# EAGLE design ciborg-4 (EAGLE 4.13)
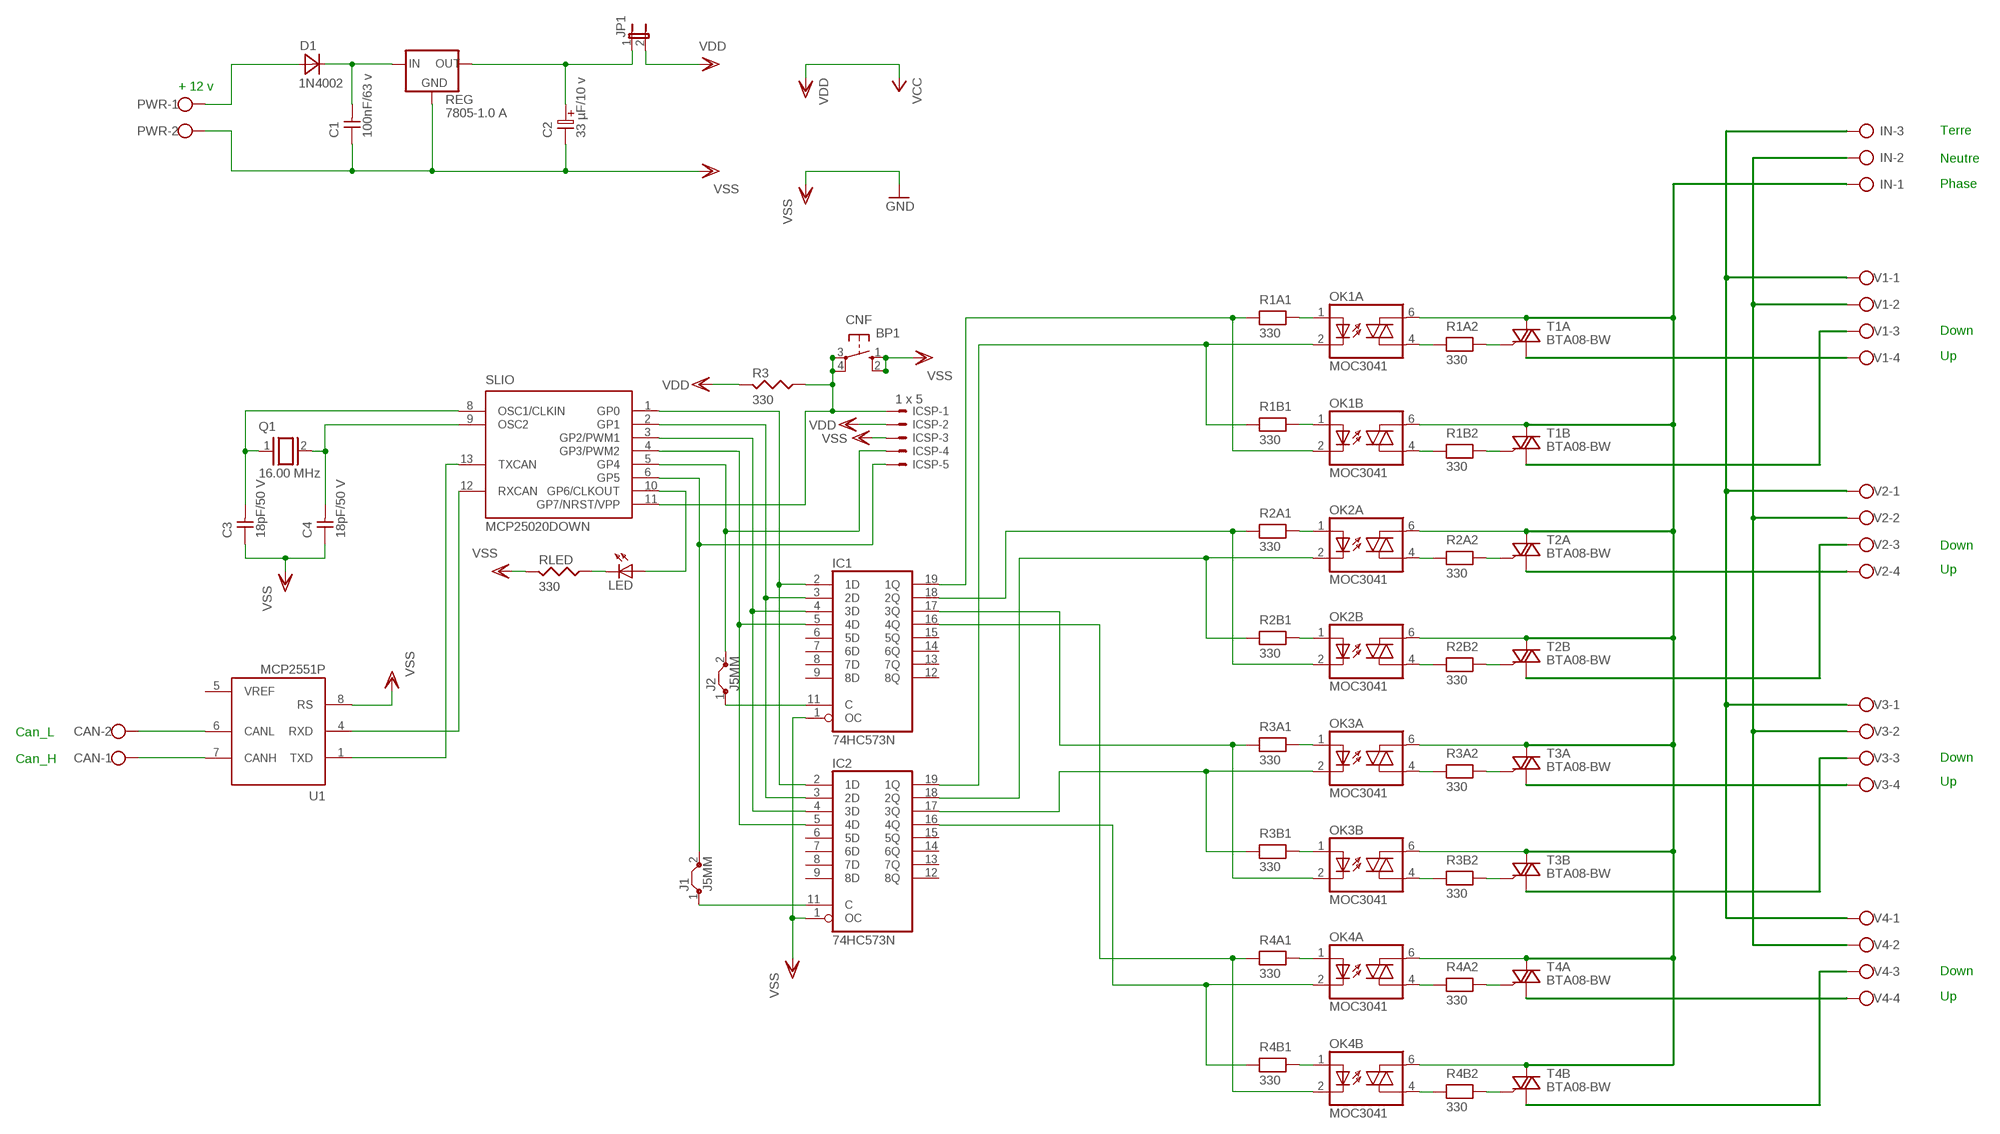
[diagram p0: schematic, sheet 1]

## Parts
C1  100nF/63 v  CAPNP-5  [C-5]
C2  33 µF/10 v  ELC-2,5L  [ES-2,5L]
C3  18pF/50 V  CAPNP-5  [C-5]
C4  18pF/50 V  CAPNP-5  [C-5]
CAN  AK550/2  [AK550/2]
CNF  BP1  10-XX  [B3F-10XX]
D1  1N4002  DIODE-10  [D-10]
IC1  74HC573N  [DIL20]
IC2  74HC573N  [DIL20]
ICSP  1 x 5  53047-05  [53047-05]
IN  AK500/3  [AK500/3]
J1  J5MM  [05]
J2  J5MM  [05]
JP1  JP1E  [JP1]
LED  LED3MM  [LED3MM]
OK1A  MOC3041  IL420  [DIL06]
OK1B  MOC3041  IL420  [DIL06]
OK2A  MOC3041  IL420  [DIL06]
OK2B  MOC3041  IL420  [DIL06]
OK3A  MOC3041  IL420  [DIL06]
OK3B  MOC3041  IL420  [DIL06]
OK4A  MOC3041  IL420  [DIL06]
OK4B  MOC3041  IL420  [DIL06]
PWR  AK550/2  [AK550/2]
Q1  16.00 MHz  XTAL/S  [QS]
R1A1  330  RESEU-7,5  [R-7,5]
R1A2  330  RESEU-S2,5  [RS-2,5]
R1B1  330  RESEU-7,5  [R-7,5]
R1B2  330  RESEU-S2,5  [RS-2,5]
R2A1  330  RESEU-7,5  [R-7,5]
R2A2  330  RESEU-S2,5  [RS-2,5]
R2B1  330  RESEU-7,5  [R-7,5]
R2B2  330  RESEU-S2,5  [RS-2,5]
R3  330  RESUS-S2,5  [RS-2,5]
R3A1  330  RESEU-7,5  [R-7,5]
R3A2  330  RESEU-S2,5  [RS-2,5]
R3B1  330  RESEU-7,5  [R-7,5]
R3B2  330  RESEU-S2,5  [RS-2,5]
R4A1  330  RESEU-7,5  [R-7,5]
R4A2  330  RESEU-S2,5  [RS-2,5]
R4B1  330  RESEU-7,5  [R-7,5]
R4B2  330  RESEU-S2,5  [RS-2,5]
REG  7805-1.0 A  78XXS  [78XXS]
RLED  330  RESUS-S2,5  [RS-2,5]
SLIO  MCP25020DOWN  [SO-14DOWN]
T1A  BTA08-BW  TIC225S  [TO220DS]
T1B  BTA08-BW  TIC225S  [TO220DS]
T2A  BTA08-BW  TIC225S  [TO220DS]
T2B  BTA08-BW  TIC225S  [TO220DS]
T3A  BTA08-BW  TIC225S  [TO220DS]
T3B  BTA08-BW  TIC225S  [TO220DS]
T4A  BTA08-BW  TIC225S  [TO220DS]
T4B  BTA08-BW  TIC225S  [TO220DS]
U1  MCP2551P  [DIL8]
V1  AK500/4  [AK500/4]
V2  AK500/4  [AK500/4]
V3  AK500/4  [AK500/4]
V4  AK500/4  [AK500/4]

## Nets
CANH: CAN.1 U1.7(CANH)
CANL: CAN.2 U1.6(CANL)
N$1: LED.K(C) RLED.1
N$2: C2.1 JP1.1 REG.OUT
N$3: C4.2 Q1.2 SLIO.9(OSC2)
N$4: IC2.11(C) J1.1
N$5: ICSP.5 J1.2 SLIO.6(GP5)
N$6: C3.2 Q1.1 SLIO.8(OSC1/CLKIN)
N$7: C1.2 D1.2(K) REG.IN
N$8: SLIO.12(RXCAN) U1.4(RXD)
N$9: SLIO.13(TXCAN) U1.1(TXD)
N$10: IC1.11(C) J2.1
N$11: IC1.19(1Q) OK1B.2(C) R1A1.1
N$12: IC2.19(1Q) OK1A.2(C) R1B1.1
N$13: OK1A.1(A) R1A1.2
N$14: ICSP.4 J2.2 SLIO.5(GP4)
N$15: D1.1(A) PWR.1
N$16: LED.A SLIO.10(GP6/CLKOUT)
N$17: OK1B.1(A) R1B1.2
N$18 [AC_VOLTAGE]: T1A.A1 V1.4
N$19: OK2A.1(A) R2A1.2
N$20 [AC_VOLTAGE]: OK2B.4(A1) R2B2.1
N$21 [AC_VOLTAGE]: R2B2.2 T2B.G
N$22: OK2B.1(A) R2B1.2
N$23 [AC_VOLTAGE]: OK2A.4(A1) R2A2.1
N$24 [AC_VOLTAGE]: R2A2.2 T2A.G
N$25: IC1.18(2Q) OK2B.2(C) R2A1.1
N$26: IC2.18(2Q) OK2A.2(C) R2B1.1
N$27: OK3B.1(A) R3B1.2
N$28: OK4A.1(A) R4A1.2
N$29: OK4B.1(A) R4B1.2
N$30 [AC_VOLTAGE]: OK3B.4(A1) R3B2.1
N$31 [AC_VOLTAGE]: R3B2.2 T3B.G
N$32: OK3A.1(A) R3A1.2
N$33 [AC_VOLTAGE]: OK3A.4(A1) R3A2.1
N$34 [AC_VOLTAGE]: R3A2.2 T3A.G
N$35: IC1.17(3Q) OK3B.2(C) R3A1.1
N$36: IC2.17(3Q) OK3A.2(C) R3B1.1
N$38 [AC_VOLTAGE]: T2A.A1 V2.4
N$39 [AC_VOLTAGE]: OK1B.4(A1) R1B2.1
N$40 [AC_VOLTAGE]: R1B2.2 T1B.G
N$41 [AC_VOLTAGE]: T3A.A1 V3.4
N$42 [AC_VOLTAGE]: T4A.A1 V4.4
N$43 [AC_VOLTAGE]: OK4B.4(A1) R4B2.1
N$44 [AC_VOLTAGE]: R4B2.2 T4B.G
N$45 [AC_VOLTAGE]: T4B.A1 V4.3
N$46 [AC_VOLTAGE]: OK4A.4(A1) R4A2.1
N$47 [AC_VOLTAGE]: R4A2.2 T4A.G
N$48: IC1.16(4Q) OK4B.2(C) R4A1.1
N$49: IC2.16(4Q) OK4A.2(C) R4B1.1
N$50 [AC_VOLTAGE]: T3B.A1 V3.3
N$51 [AC_VOLTAGE]: T2B.A1 V2.3
N$52 [AC_VOLTAGE]: T1B.A1 V1.3
N$59 [AC_VOLTAGE]: OK1A.4(A1) R1A2.1
N$60 [AC_VOLTAGE]: R1A2.2 T1A.G
NEUTRE [AC_VOLTAGE]: IN.2 V1.2 V2.2 V3.2 V4.2
PHASE [AC_VOLTAGE]: IN.1 OK1A.6(A2) OK1B.6(A2) OK2A.6(A2) OK2B.6(A2) OK3A.6(A2) OK3B.6(A2) OK4A.6(A2) OK4B.6(A2) T1A.A2 T1B.A2 T2A.A2 T2B.A2 T3A.A2 T3B.A2 T4A.A2 T4B.A2
TERRE [AC_TERRE]: IN.3 V1.1 V2.1 V3.1 V4.1
VDD: ICSP.2 JP1.2 R3.2
VPP: CNF.3(P) CNF.4(P1) ICSP.1 R3.1 SLIO.11(GP7/NRST/VPP)
VR1_UP: IC1.2(1D) IC2.2(1D) SLIO.1(GP0)
VR2_UP: IC1.3(2D) IC2.3(2D) SLIO.2(GP1)
VR3_UP: IC1.4(3D) IC2.4(3D) SLIO.3(GP2/PWM1)
VR4_UP: IC1.5(4D) IC2.5(4D) SLIO.4(GP3/PWM2)
VSS: C1.1 C2.2 C3.1 C4.1 CNF.1(S) CNF.2(S1) IC1.1(OC) IC2.1(OC) ICSP.3 PWR.2 REG.GND RLED.2 U1.8(RS)
Unconnected: IC1.6(5D) IC1.7(6D) IC1.8(7D) IC1.9(8D) IC1.12(8Q) IC1.13(7Q) IC1.14(6Q) IC1.15(5Q) IC2.6(5D) IC2.7(6D) IC2.8(7D) IC2.9(8D) IC2.12(8Q) IC2.13(7Q) IC2.14(6Q) IC2.15(5Q)

## Notes on the sheet
- + 12 v
- Terre
- Neutre
- Phase
- Down
- Up
- Down
- Up
- Can_L
- Can_H | Down
- Up
- Down
- Up

## Power pins joined to a net without a drawn wire
GND: IC1.10(GND) IC2.10(GND)
VCC: IC1.20(VCC) IC2.20(VCC)
VDD: SLIO.14(VDD) U1.3(VDD)
VREF: U1.5(VREF)
VSS: SLIO.7(VSS) U1.2(VSS)

## Library data of the parts
C1 C3 C4 = discrete:CAPNP-5
C2 = discrete:ELC-2,5L
CAN PWR = con-ptr500+:AK550/2: CONNECTOR
CNF = switch-omron:10-XX: OMRON SWITCH
D1 = discrete:DIODE-10
IC1 IC2 = 74xx-eu:74*573: 8-bit D latch BUS DRIVER
ICSP = con-molex:53?-05: CONNECTOR wire to board 1.25 mm (.049 inch) pitch header
IN = con-ptr500:AK500/3: CONNECTOR
J1 J2 = jumper:J: Bridge
JP1 = jumper:JP1E: JUMPER
LED = led:LED: LED
OK1A OK1B OK2A OK2B OK3A OK3B OK4A OK4B = optocoupler:IL420: SIEMENS OPTO COUPLER
Q1 = special:XTAL/S: CRYSTAL
R1A1 R1B1 R2A1 R2B1 R3A1 R3B1 R4A1 R4B1 = discrete:RESEU-7,5
R1A2 R1B2 R2A2 R2B2 R3A2 R3B2 R4A2 R4B2 = discrete:RESEU-S2,5
R3 RLED = discrete:RESUS-S2,5
REG = v-reg:78XXS: VOLTAGE REGULATOR
SLIO = microchip_can:MCP25020: CAN I/O Expander
T1A T1B T2A T2B T3A T3B T4A T4B = triac:TIC225S: TRIAC
U1 = microchip_can:MCP2551: High Speed CAN tranceiver
V1-V4 = con-ptr500+:AK500/4: CONNECTOR

## Net classes
0 default: width 0.254 mm, drill 0.254 mm
1 AC_VOLTAGE: width 1.5 mm, drill 0.254 mm
2 AC_TERRE: width 1.422 mm, drill 0.254 mm

## Board
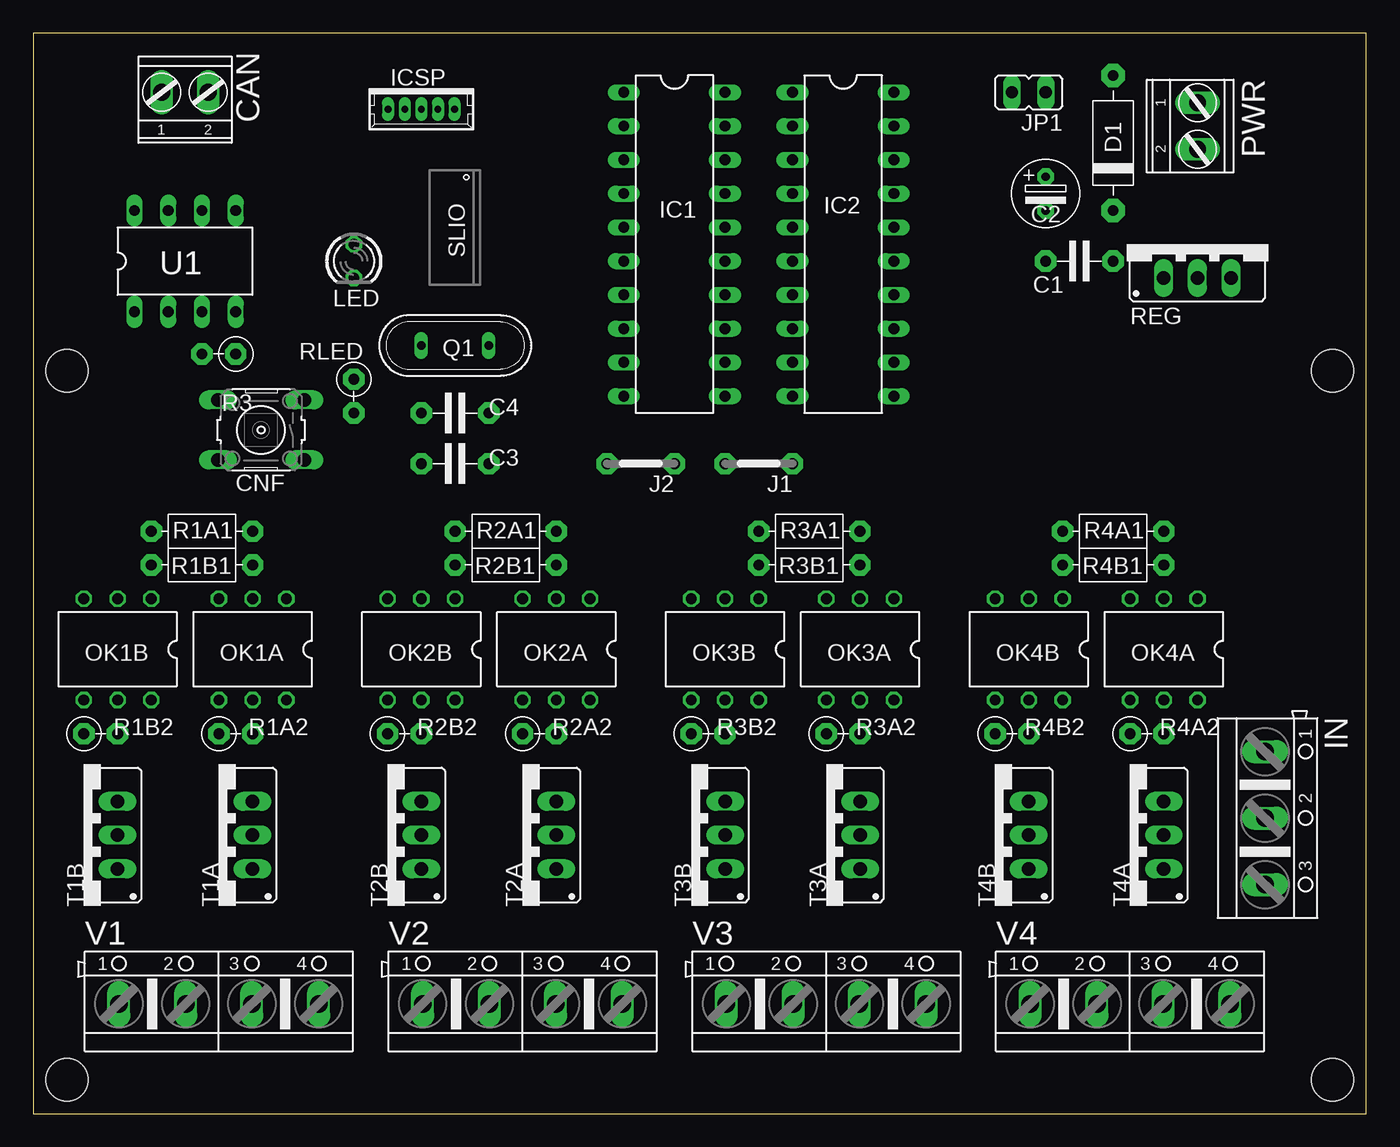
[diagram p1: board, top side]
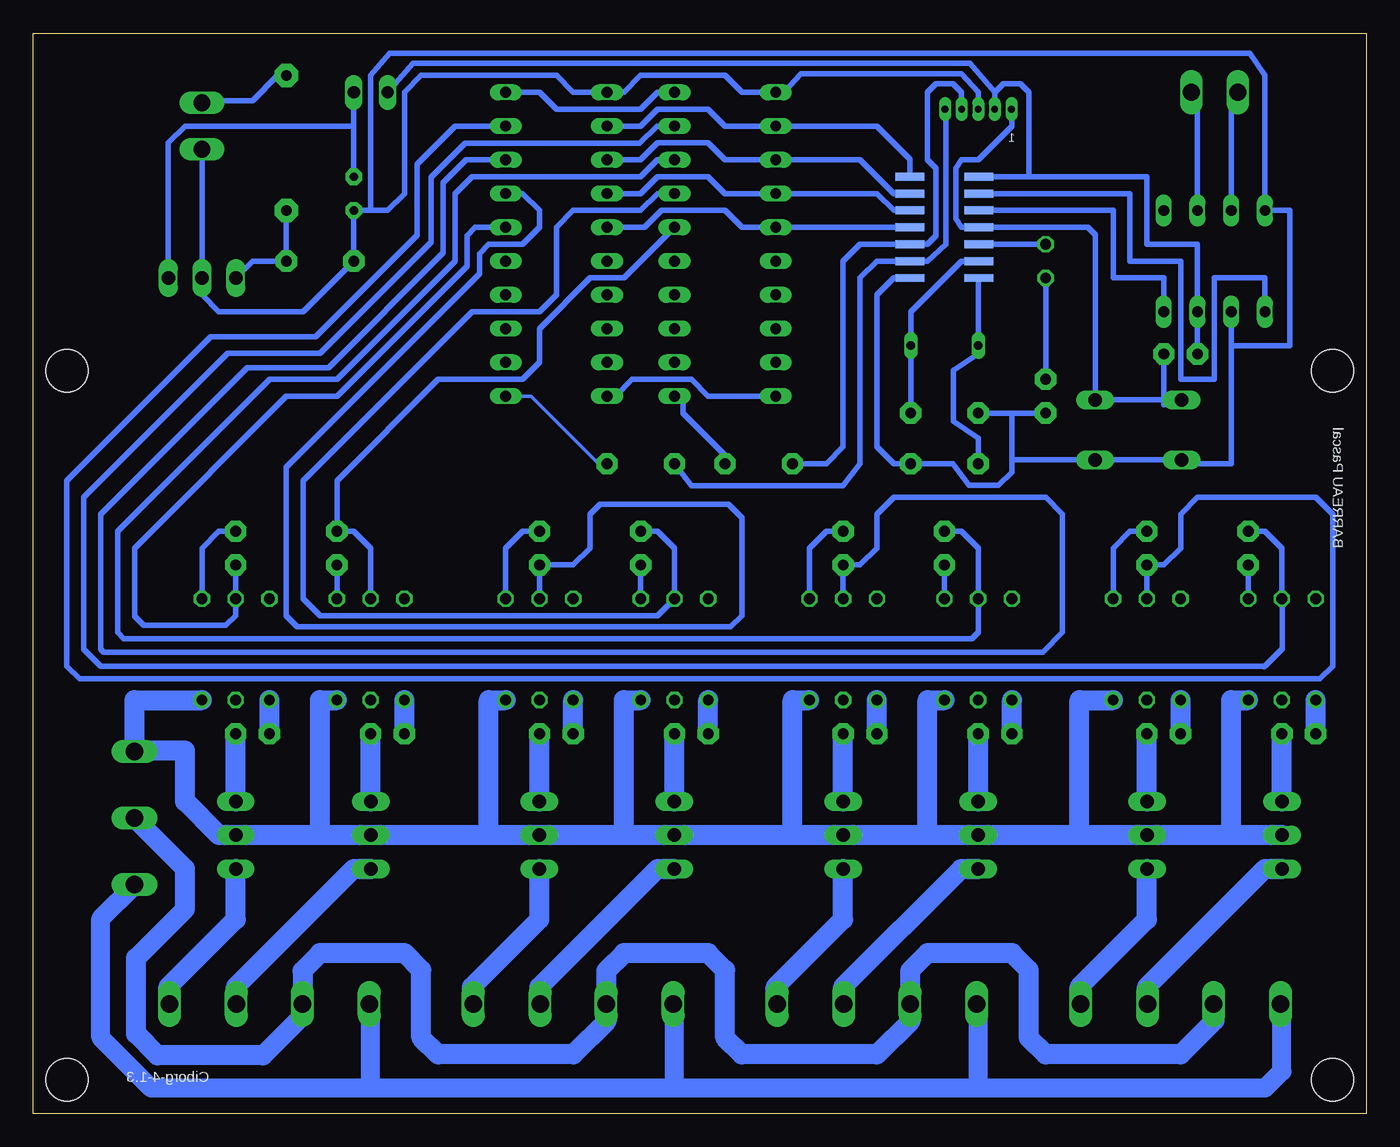
[diagram p2: board, bottom side, seen from below]

Size 100.33 x 81.28 mm. Coordinates in mm from the lower left corner, seen from the top.
Outline: 0,0 100.33,0 100.33,81.28 0,81.28 0,0
Copper layers (1*16): Top 0.0356mm / dielectric 1.5011mm / Bottom 0.0356mm
Design rules "BARREAU_DRU": minimum track width 10mil, minimum drill 19mil, track to track 10mil, track to pad 10mil, pad to pad 10mil, via to via 10mil, smd to smd 8mil, copper to edge 40mil, drill to drill 10mil, minimum pad ring 8mil, minimum via ring 8mil, stop-mask expansion 4mil, vias tented up to drill 0mil, thermal gap 10mil
Holes 3.2 mm at 97.79,2.54 2.54,2.54 2.54,55.88 97.79,55.88

### Footprints (pad centres in the part's own frame; a part is rotated, then mirrored left to right if it is on the bottom)
C-5 = drill 0.813 pad 1.6 octagon: 1 -2.54,0; 2 2.54,0
ES-2,5L = drill 0.61 pad 1.27 octagon: 1 0,0; 2 2.54,0
AK550/2 = drill 1.27 long: 1 -1.75,0; 2 1.75,0
B3F-10XX = drill 1.016 long: 1 -3.251,2.261; 2 3.251,2.261; 3 -3.251,-2.261; 4 3.251,-2.261
D-10 = drill 0.813 pad 1.778 octagon: 1 -5.08,0; 2 5.08,0
DIL20 = drill 0.813 long: 1 -11.43,-3.81; 2 -8.89,-3.81; 3 -6.35,-3.81; 4 -3.81,-3.81; 5 -1.27,-3.81; 6 1.27,-3.81; 7 3.81,-3.81; 8 6.35,-3.81; 9 8.89,-3.81; 10 11.43,-3.81; 11 11.43,3.81; 12 8.89,3.81; 13 6.35,3.81; 14 3.81,3.81; 15 1.27,3.81; 16 -1.27,3.81; 17 -3.81,3.81; 18 -6.35,3.81; 19 -8.89,3.81; 20 -11.43,3.81
53047-05 = drill 0.5 pad 0.698 long: 1 2.5,0; 2 1.25,0; 3 0,0; 4 -1.25,0; 5 -2.5,0
AK500/3 = drill 1.321 long: 1 -5.004,0; 2 0,0; 3 5.004,0
05 = drill 0.813 pad 1.6 octagon: 1 -2.54,0; 2 2.54,0
JP1 = drill 0.914 long: 1 0,-1.27; 2 0,1.27
LED3MM = drill 0.813 octagon: A -1.27,0; K 1.27,0
DIL06 = drill 0.813 octagon: 1 -2.54,-3.81; 2 0,-3.81; 3 2.54,-3.81; 4 2.54,3.81; 5 0,3.81; 6 -2.54,3.81
QS = drill 0.61 long: 1 -2.54,0; 2 2.54,0
R-7,5 = drill 0.813 pad 1.6 octagon: 1 -3.81,0; 2 3.81,0
RS-2,5 = drill 0.813 pad 1.6 octagon: 1 0,0; 2 2.54,0
78XXS = drill 1.016 long: GND 0,-2.54; IN -2.54,-2.54; OUT 2.54,-2.54
SO-14DOWN = smd 0.6 x 2.2 bottom: 1 3.81,-2.6; 2 2.54,-2.6; 3 1.27,-2.6; 4 0,-2.6; 5 -1.27,-2.6; 6 -2.54,-2.6; 7 -3.81,-2.6; 8 -3.81,2.6; 9 -2.54,2.6; 10 -1.27,2.6; 11 0,2.6; 12 1.27,2.6; 13 2.54,2.6; 14 3.81,2.6
TO220DS = drill 1.016 long: A1 -2.54,-2.54; A2 0,-2.54; G 2.54,-2.54
DIL8 = drill 0.813 long: 1 -3.81,-3.81; 2 -1.27,-3.81; 3 1.27,-3.81; 4 3.81,-3.81; 5 3.81,3.81; 6 1.27,3.81; 7 -1.27,3.81; 8 -3.81,3.81
AK500/4 = drill 1.321 long: 1 -7.518,0; 2 -2.489,0; 3 2.489,0; 4 7.518,0

### Placement (x,y rotation side)
C1  78.74,64.14 0 top
C2  76.2,70.48 270 top
C3  31.75,48.9 180 top
C4  31.75,52.7 0 top
CAN  11.43,76.83 0 top
CNF  17.14,51.44 180 top
D1  81.28,73.03 270 top
IC1  48.26,65.41 270 top
IC2  60.96,65.41 270 top
ICSP  29.21,75.56 180 top
IN  92.71,22.23 270 top
J1  54.61,48.9 180 top
J2  45.72,48.9 180 top
JP1  74.93,76.83 90 top
LED  24.13,64.14 270 top
OK1A  16.51,34.92 180 top
OK1B  6.35,34.92 180 top
OK2A  39.37,34.92 180 top
OK2B  29.21,34.92 180 top
OK3A  62.23,34.92 180 top
OK3B  52.07,34.92 180 top
OK4A  85.09,34.92 180 top
OK4B  74.93,34.92 180 top
PWR  87.63,74.3 270 top
Q1  31.75,57.78 0 top
R1A1  12.7,43.81 0 top
R1A2  13.97,28.57 0 top
R1B1  12.7,41.27 180 top
R1B2  3.81,28.57 0 top
R2A1  35.56,43.81 0 top
R2A2  36.83,28.57 0 top
R2B1  35.56,41.27 180 top
R2B2  26.67,28.57 0 top
R3  15.24,57.15 180 top
R3A1  58.42,43.81 0 top
R3A2  59.69,28.57 0 top
R3B1  58.42,41.27 180 top
R3B2  49.53,28.57 0 top
R4A1  81.28,43.81 0 top
R4A2  82.55,28.57 0 top
R4B1  81.28,41.27 180 top
R4B2  72.39,28.57 0 top
REG  87.63,65.41 0 top
RLED  24.13,55.24 270 top
SLIO  31.75,66.67 90 top
T1A  13.97,20.95 90 top
T1B  3.81,20.95 90 top
T2A  36.83,20.95 90 top
T2B  26.67,20.95 90 top
T3A  59.69,20.95 90 top
T3B  49.53,20.95 90 top
T4A  82.55,20.95 90 top
T4B  72.39,20.95 90 top
U1  11.43,64.14 0 top
V1  13.97,8.26 0 top
V2  36.83,8.26 0 top
V3  59.69,8.26 0 top
V4  82.55,8.26 0 top

### Tracks (layer width: path | path; a pad name or v marks a point on that pad's centre or on a via)
CANH
  Bottom 0.406: U1.7 10.16,75.56 CAN.1
CANL
  Bottom 0.406: U1.6 12.7,75.56 CAN.2
GND
  Bottom 0.406: IC1.10 49.53,53.98 50.8,55.24 55.24,55.24 56.52,53.98 IC2.10
N$1
  Bottom 0.406: RLED.1 LED.K
N$2
  Bottom 0.406: C2.1 76.2,74.3 | 76.2,74.3 JP1.1 | 76.2,74.3 88.9,74.3 90.17,73.03 REG.OUT
N$3
  Bottom 0.406: C4.2 Q1.2 34.29,60.33 30.48,64.14 SLIO.9
N$4
  Bottom 0.254: IC2.11 62.87,53.98 57.78,48.9 J1.1
N$5
  Bottom 0.254: 31.64,74.93 ICSP.5
  Bottom 0.406: 31.64,74.93 31.64,65.41 33.02,64.14 SLIO.6 36.83,64.14 38.1,62.87 38.1,48.9 39.37,47.22 50.8,47.22 J1.2
N$6
  Bottom 0.254: 29.21,62.87 SLIO.8
  Bottom 0.406: 29.21,62.87 Q1.1 29.21,57.15 31.06,55.91 31.06,52.1 29.21,50.8 C3.2
N$7
  Bottom 0.406: REG.IN 83.82,64.14 C1.2 D1.2
N$8
  Bottom 0.406: SLIO.12 19.05,67.94 19.05,62.87 15.24,62.87 U1.4
N$9
  Bottom 0.406: U1.1 7.62,62.87 11.43,62.87 11.43,55.24 13.97,55.24 13.97,64.14 17.78,64.14 17.78,69.22 SLIO.13
N$10
  Bottom 0.254: 51.44,53.98 IC1.11
  Bottom 0.406: 51.44,53.98 51.44,52.7 48.26,49.53 J2.1
N$11
  Bottom 0.254: 7.64,33.67 7.62,33.66
  Bottom 0.406: IC1.19 53.39,74.3 54.69,73 67.83,73 70.39,70.44 70.39,65.55 78.74,57.19 85.68,57.19 96.52,46.35 96.52,34.92 95.25,33.66 7.62,33.66 | 7.71,33.6 7.64,33.67 6.33,34.98 6.33,38.72 OK1B.2 6.35,42.55 7.62,43.81 R1A1.1
N$12
  Bottom 0.406: OK1A.2 R1B1.1 15.24,41.27 13.97,42.55 13.97,45.09 12.7,46.35 3.81,46.35 2.54,45.09 2.54,33.66 3.49,32.71 96.84,32.71 97.79,33.66 97.79,47.62 86.96,58.45 79.07,58.45 71.46,66.06 71.46,71.42 68.58,74.3 IC2.19
N$13
  Bottom 0.406: R1A1.2 17.78,43.81 19.05,42.55 OK1A.1
N$14
  Bottom 0.254: 30.48,76.2 ICSP.4
  Bottom 0.406: 30.48,76.2 30.48,76.83 31.11,77.47 32.38,77.47 33.02,76.83 33.02,71.75 32.38,71.12 32.38,66.04 33.02,65.41 SLIO.5 38.1,65.41 39.37,64.14 39.37,50.16 40.64,48.9 J2.2
N$15
  Bottom 0.254: 86.36,76.2 PWR.1
  Bottom 0.406: 86.36,76.2 83.82,76.2 81.92,78.11 D1.1
N$16
  Bottom 0.406: LED.A SLIO.10
N$17
  Bottom 0.406: OK1B.1 R1B1.2
N$18
  Bottom 1.5: T1A.A1 16.51,14.61 21.59,9.53 21.59,8.26 V1.4
N$19
  Bottom 0.406: R2A1.2 40.64,43.81 41.91,42.55 OK2A.1
N$20
  Bottom 1.5: R2B2.1 OK2B.4
N$21
  Bottom 1.5: T2B.G R2B2.2
N$22
  Bottom 0.406: OK2B.1 R2B1.2
N$23
  Bottom 1.5: R2A2.1 OK2A.4
N$24
  Bottom 1.5: T2A.G R2A2.2
N$25
  Bottom 0.406: IC1.18 53.34,71.75 54.61,70.48 67.31,70.48 68.58,69.22 68.58,64.14 77.47,55.24 82.55,55.24 93.98,43.81 93.98,36.2 93.51,35.73 29.68,35.73 29.21,36.2 OK2B.2 29.21,42.55 30.48,43.81 R2A1.1
N$26
  Bottom 0.406: IC2.18 67.75,71.75 69.47,70.03 69.47,64.75 78.11,56.12 84.22,56.12 95.25,45.09 95.25,34.92 95.04,34.71 92.05,34.71 24.34,34.71 22.86,36.2 22.86,45.09 24.13,46.35 35.56,46.35 36.83,45.09 36.83,42.55 38.1,41.27 R2B1.1 OK2A.2 39.37,38.65 39.36,38.63
N$27
  Bottom 0.406: OK3B.1 R3B1.2
N$28
  Bottom 0.406: R4A1.2 86.36,43.81 87.63,42.55 OK4A.1
N$29
  Bottom 0.406: OK4B.1 R4B1.2
N$30
  Bottom 1.5: R3B2.1 OK3B.4
N$31
  Bottom 1.5: T3B.G R3B2.2
N$32
  Bottom 0.406: R3A1.2 63.5,43.81 64.77,42.55 OK3A.1
N$33
  Bottom 1.5: R3A2.1 OK3A.4
N$34
  Bottom 1.5: T3A.G R3A2.2
N$35
  Bottom 0.406: IC1.17 53.34,69.22 54.61,67.94 59.69,67.94 60.96,66.67 60.96,61.59 62.23,60.33 67.31,60.33 80.01,47.62 80.01,38.73 78.74,37.47 53.34,37.47 OK3B.2 52.07,42.55 53.34,43.81 R3A1.1
N$36
  Bottom 0.406: OK3A.2 R3B1.1 59.69,41.27 58.42,42.55 58.42,45.09 57.67,45.84 47.99,45.84 46.99,44.84 46.99,37.47 47.84,36.62 79.28,36.62 79.3,36.64 80.45,36.64 81.28,37.47 81.28,48.63 77.23,52.68 77.23,52.7 66.75,63.18 66.75,64.7 66.04,65.41 63.5,65.41 62.23,66.67 62.23,67.94 63.5,69.22 IC2.17
N$38
  Bottom 1.5: T2A.A1 39.37,14.61 44.45,9.53 44.45,8.26 V2.4
N$39
  Bottom 1.5: R1B2.1 OK1B.4
N$40
  Bottom 1.5: T1B.G R1B2.2
N$41
  Bottom 1.5: T3A.A1 62.23,14.61 67.31,9.53 67.31,8.26 V3.4
N$42
  Bottom 1.5: T4A.A1 85.09,14.61 90.17,9.53 90.17,8.26 V4.4
N$43
  Bottom 1.5: R4B2.1 OK4B.4
N$44
  Bottom 1.5: T4B.G R4B2.2
N$45
  Bottom 1.5: T4B.A1 76.2,18.41 85.09,9.53 85.09,8.26 V4.3
N$46
  Bottom 1.5: R4A2.1 OK4A.4
N$47
  Bottom 1.5: T4A.G R4A2.2
N$48
  Bottom 0.406: IC1.16 55.88,62.87 58.42,62.87 62.23,59.05 62.23,56.52 63.5,55.24 69.85,55.24 77.47,47.62 R4A1.1 76.2,43.81 74.93,42.55 OK4B.2
N$49
  Bottom 0.406: R4B1.1 OK4A.2 85.09,37.47 85.83,36.73 92.02,36.73 92.71,37.42 92.71,42.55 81.28,53.98 77.47,53.98 67.69,63.76 67.69,66.06 67.08,66.67 IC2.16
N$50
  Bottom 1.5: T3B.A1 53.34,18.41 62.23,9.53 62.23,8.26 V3.3
N$51
  Bottom 1.5: T2B.A1 30.48,18.41 39.37,9.53 39.37,8.26 V2.3
N$52
  Bottom 1.5: T1B.A1 7.62,18.41 16.51,9.53 16.51,8.26 V1.3
N$59
  Bottom 1.5: R1A2.1 OK1A.4
N$60
  Bottom 1.5: T1A.G R1A2.2
NEUTRE
  Bottom 1.5: IN.2 88.91,18.42 88.91,15.38 92.59,11.69 92.59,5.99 90.98,4.38 83.03,4.38 80.1,7.31 80.1,8.24 80.08,8.24 V4.2 80.06,10.74 78.74,12.06 72.39,12.06 71.12,10.79 71.12,5.71 69.85,4.45 59.69,4.45 57.15,6.99 57.15,8.26 V3.2 57.2,10.74 55.88,12.06 49.53,12.06 48.26,10.79 48.26,5.71 46.99,4.45 36.83,4.45 34.29,6.99 34.29,8.26 V2.2 34.34,10.74 33.02,12.06 26.67,12.06 25.4,10.79 25.4,5.71 24.13,4.45 13.97,4.45 11.43,6.99 11.43,8.26 V1.2
PHASE
  Bottom 1.5: 78.74,20.95 T4B.A2 66.04,20.95 | 78.74,20.95 T4A.A2 86.36,20.95 88.9,23.5 88.9,27.3 92.71,27.3 | T1B.A2 10.16,20.95 | 10.16,20.95 T1A.A2 21.59,20.95 | 21.59,20.95 T2B.A2 33.02,20.95 | 33.02,20.95 T2A.A2 43.18,20.95 | 43.18,20.95 T3B.A2 55.88,20.95 | 55.88,20.95 T3A.A2 66.04,20.95 | OK1B.6 10.16,31.11 10.16,20.95 | OK1A.6 21.59,31.11 21.59,20.95 | OK2B.6 33.02,31.11 33.02,20.95 | OK2A.6 43.18,31.11 43.18,20.95 | OK3B.6 55.88,31.11 55.88,20.95 | OK3A.6 66.04,31.11 66.04,20.95 | OK4B.6 78.74,31.11 78.74,20.95 | OK4A.6 92.71,31.11 92.71,27.3 | 92.71,27.3 IN.1
TERRE
  Bottom 1.422: IN.3 95.25,14.68 95.25,5.71 91.44,1.91 74.93,1.91 | 29.21,1.91 7.62,1.91 6.35,3.17 6.35,8.26 V1.1 | 29.21,1.91 52.07,1.91 | 52.07,1.91 74.93,1.91 | V2.1 29.21,8.15 29.21,1.91 | V3.1 52.07,8.15 52.07,1.91 | V4.1 74.93,8.15 74.93,1.91
VCC
  Bottom 0.406: IC1.20 53.34,76.83 54.61,75.56 60.96,75.56 62.23,76.83 IC2.20
VDD
  Bottom 0.254: 27.94,76.2 ICSP.2 | SLIO.14 28.57,70.48
  Bottom 0.406: 27.94,76.83 27.94,76.2 | 27.94,76.83 27.3,77.47 26.04,77.47 25.4,76.83 25.4,70.48 | 27.94,76.83 29.82,79.02 71.73,79.02 JP1.2 | 29.21,70.48 SLIO.14 25.4,70.48 | 25.4,70.48 16.51,70.48 16.51,65.41 12.7,65.41 U1.3 R3.2
VPP
  Bottom 0.254: 26.67,74.93 ICSP.1
  Bottom 0.406: 26.67,74.93 26.67,74.3 29.21,71.75 30.48,71.75 30.89,71.12 30.89,67.31 30.48,66.67 SLIO.11 20.95,66.67 20.4,66.12 CNF.3 20.4,53.9 20.32,53.98 20.04,53.7 15.24,53.7 | CNF.4 15.24,53.7 | 15.24,53.7 15.24,53.34 | 15.24,53.7 R3.1
VR1_UP
  Bottom 0.406: SLIO.1 34.35,71.81 36.83,74.3 IC1.2 48.26,74.3 49.53,75.56 53.34,75.56 54.61,74.3 IC2.2
VR2_UP
  Bottom 0.406: SLIO.2 35.56,69.22 38.1,71.75 IC1.3 48.26,71.75 49.53,73.03 53.34,73.03 54.61,71.75 IC2.3
VR3_UP
  Bottom 0.406: SLIO.3 35.56,67.94 36.83,69.22 IC1.4 48.26,69.22 49.53,70.48 53.34,70.48 54.61,69.22 IC2.4
VR4_UP
  Bottom 0.406: SLIO.4 IC1.5 46.99,66.67 48.26,67.94 53.04,67.94 54.33,66.68 55.32,66.68 55.33,66.67 IC2.5
VSS
  Bottom 0.254: IC1.1 43.81,76.83
  Bottom 0.406: 26.67,52.7 RLED.2 | 26.67,52.7 C4.1 | 43.81,76.83 42.55,78.24 30.48,78.24 29.21,76.83 ICSP.3 | PWR.2 REG.GND 87.63,61.59 86.36,60.33 80.01,60.33 C1.1 C2.2 74.93,67.94 | 10.16,57.78 U1.2 | IC1.1 46.99,76.83 48.26,78.11 54.61,78.11 55.88,76.83 IC2.1 59.69,76.83 60.96,78.11 71.12,78.11 72.39,76.83 72.39,69.22 73.66,67.94 74.93,67.94 | 74.93,67.94 74.93,78.11 73.52,79.79 8.75,79.79 7.62,78.11 U1.8 5.75,67.94 5.75,57.78 10.16,57.78 | SLIO.7 35.56,62.87 36.83,61.59 36.83,50.16 35.56,48.9 C3.1 31.11,48.9 29.9,47.26 29.88,47.26 29.87,47.26 27.68,47.26 26.67,48.26 26.67,49.21 | 10.16,57.78 10.16,48.9 13.97,48.9 13.97,49.17 | 13.97,49.17 CNF.2 | 26.67,49.21 26.67,52.7 | 26.67,49.21 26.67,49.17 CNF.1 20.4,49.45 20.32,49.53 19.96,49.17 13.97,49.17

### Text on the board
bPlace: BARREAU Pascal | Ciborg-4-1.3
bNames: 1